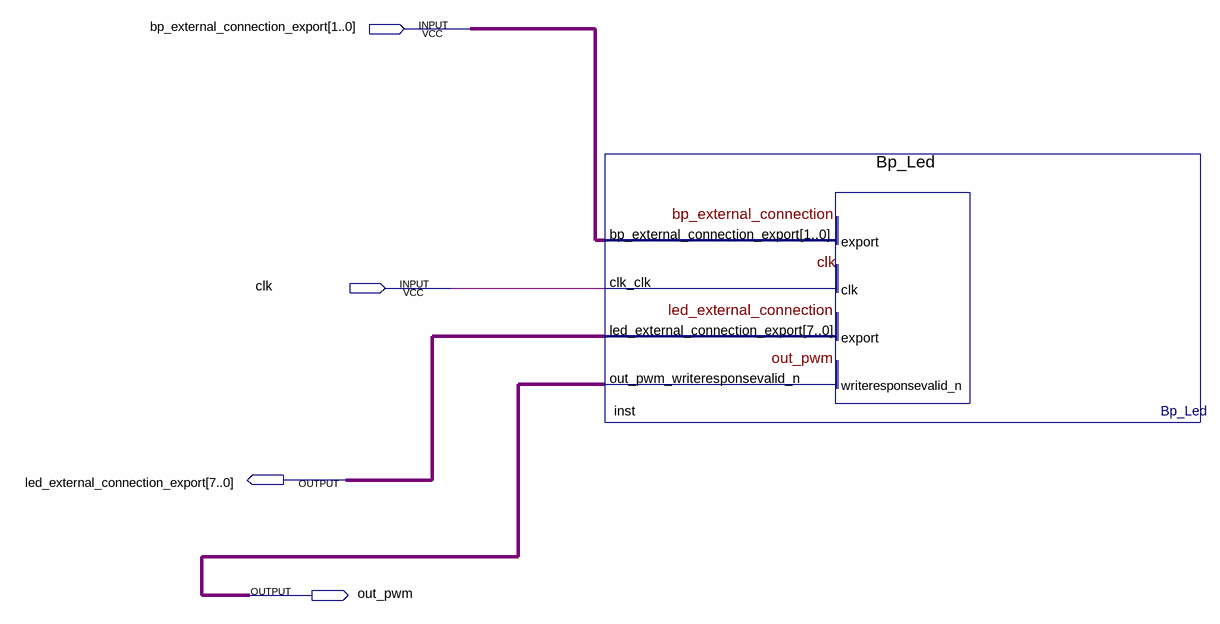
[diagram p0: schematic sheet]
// Quartus schematic LED.bdf as structural Verilog: 1 symbols, 4 pins
module LED (
  input  [1:0] bp_external_connection_export,
  input  clk,
  output [7:0] led_external_connection_export,
  output out_pwm
);

  Bp_Led inst (
    .bp_external_connection_export(bp_external_connection_export), .clk_clk(clk),
    .led_external_connection_export(led_external_connection_export), .out_pwm_writeresponsevalid_n(out_pwm));
endmodule
